# EAGLE board HedgeTrimmer_01 (EAGLE 9.4.2)
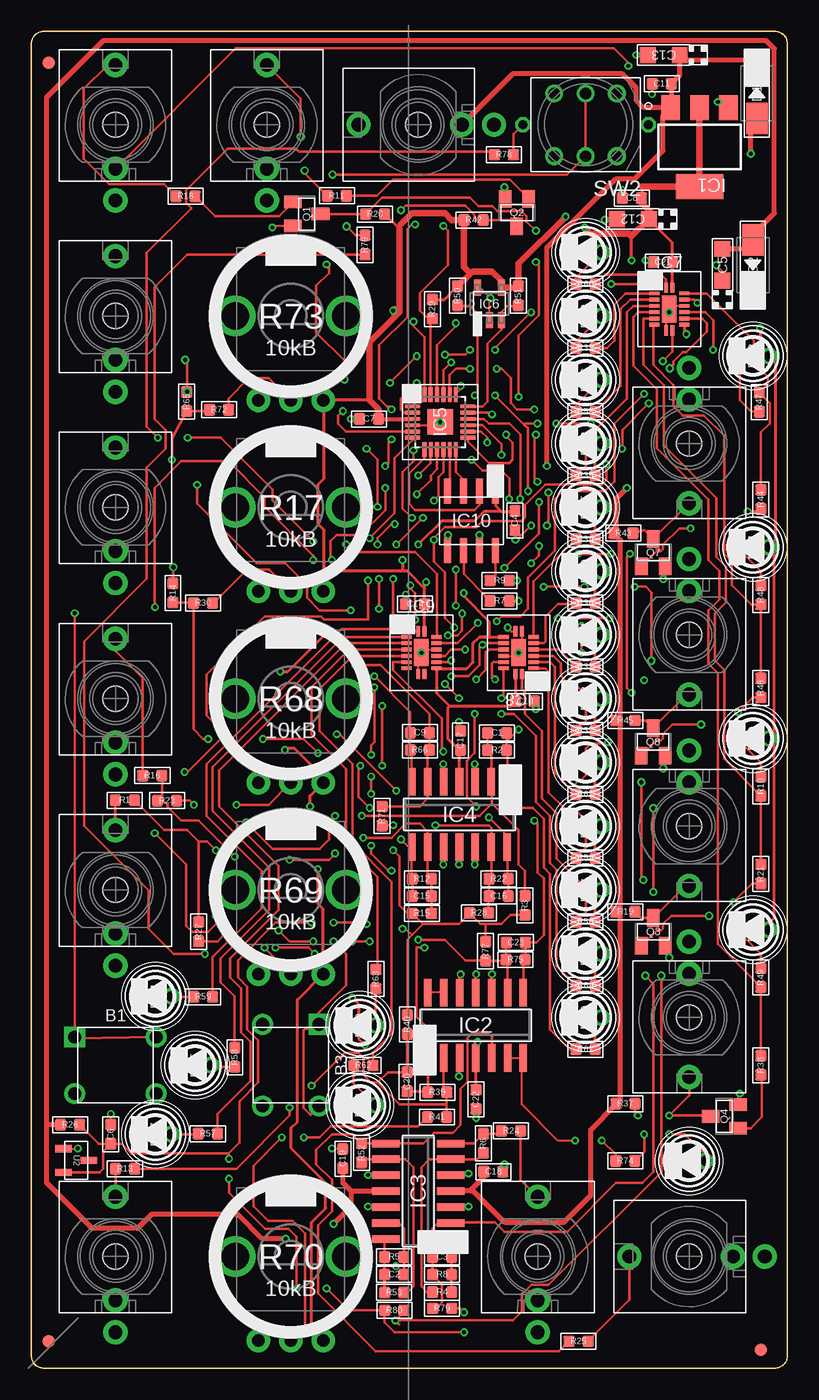
[diagram p6: board, top side]
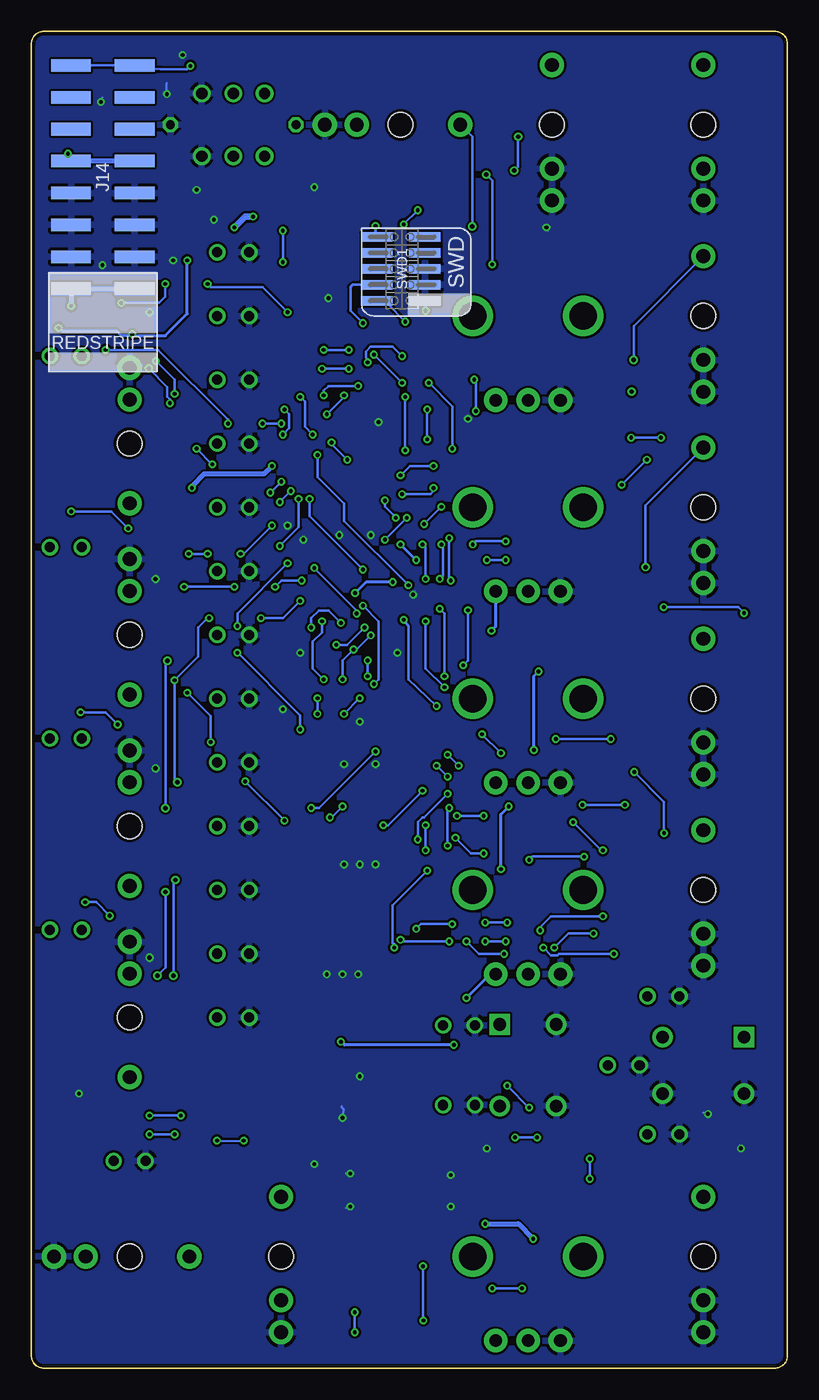
[diagram p7: board, bottom side, seen from below]

Size 60.25 x 106.5 mm. Coordinates in mm from the lower left corner, seen from the top.
Copper layers (1*16): Top 0.035mm / dielectric 1.5mm / Bottom 0.035mm
Design rules "dirt_cheap_dirty_boards.v1 *": minimum track width 5mil, minimum drill 12mil, track to track 5mil, track to pad 5mil, pad to pad 5mil, via to via 5mil, smd to smd 0mil, copper to edge 10mil, drill to drill 10mil, minimum pad ring 10mil, minimum via ring 6mil, stop-mask expansion 2mil, vias tented up to drill 25mil, thermal gap 10mil
Net classes: 0 default: width 0.203 mm, clearance 0.178 mm; 1 heavypower: width 0.381 mm; 2 mediumpower: width 0.254 mm; 3 groundplane: width 0.178 mm, clearance 0.178 mm

## Footprints (pad centres in the part's own frame; a part is rotated, then mirrored left to right if it is on the bottom)
4P-6.0X6.0X5.0H = drill 1.016 pad 1.651 square: 1 -3.25,2.25 | drill 1.016 pad 1.651: 2 -3.25,-2.25; 3 3.25,-2.25; 4 3.25,2.25
C0603 = smd 0.889 x 0.889: 1 -0.762,0; 2 0.762,0
CASE-A_3216 = smd 1.27 x 1.27: + -1.27,0; - 1.27,0
DO-214AC = smd 2.5 x 1.7: 1 -2,0; 2 2,0
3MMLED = drill 0.8: + -1.27,0; - 1.27,0
FIDUCIAL_1MM = smd 1 x 1: 1 0,0
SOT223 = smd 1.5 x 2: 1 -2.3,-3.15; 2 0,-3.15; 3 2.3,-3.15 | smd 3.8 x 2: 4 0,3.15
SO14 = smd 0.6 x 2.2: 1 -3.81,-2.6; 2 -2.54,-2.6; 3 -1.27,-2.6; 4 0,-2.6; 5 1.27,-2.6; 6 2.54,-2.6; 7 3.81,-2.6; 8 3.81,2.6; 9 2.54,2.6; 10 1.27,2.6; 11 0,2.6; 12 -1.27,2.6; 13 -2.54,2.6; 14 -3.81,2.6
QFN50P400X400X100-25N = smd 1.2 x 0.3: 1 -2.2,1.245; 2 -2.2,0.762; 3 -2.2,0.254; 4 -2.2,-0.254; 5 -2.2,-0.762; 6 -2.2,-1.245; 13 2.2,-1.245; 14 2.2,-0.762; 15 2.2,-0.254; 16 2.2,0.254; 17 2.2,0.762; 18 2.2,1.245 | smd 0.3 x 1.2: 7 -1.245,-2.2; 8 -0.762,-2.2; 9 -0.254,-2.2; 10 0.254,-2.2; 11 0.762,-2.2; 12 1.245,-2.2; 19 1.245,2.2; 20 0.762,2.2; 21 0.254,2.2; 22 -0.254,2.2 | smd 0.305 x 1.2: 23 -0.762,2.2; 24 -1.245,2.2 | smd 2.032 x 2.032: 25 0,0
SOT95P290X145-5N = smd 1.27 x 0.559: 1 -1.295,0.94; 2 -1.295,0; 3 -1.295,-0.94; 4 1.295,-0.94; 5 1.295,0.94
QFN50P250X350X100-17N = smd 0.305 x 0.813: 1 -0.254,1.702; 8 -0.254,-1.702; 9 0.254,-1.702; 16 0.254,1.702 | smd 0.813 x 0.305: 2 -1.194,1.245; 3 -1.194,0.762; 4 -1.194,0.254; 5 -1.194,-0.254; 6 -1.194,-0.762; 7 -1.194,-1.245; 10 1.194,-1.245; 11 1.194,-0.762; 12 1.194,-0.254; 13 1.194,0.254; 14 1.194,0.762; 15 1.194,1.245 | smd 1.143 x 2.159: 17 0,0
SOIC8-N_MC = smd 1.981 x 0.559: 1 -2.362,1.905; 2 -2.362,0.635; 3 -2.362,-0.635; 4 -2.362,-1.905; 5 2.362,-1.905; 6 2.362,-0.635; 7 2.362,0.635; 8 2.362,1.905
WQP_PJ_301M8 = drill 1.1 pad 1.93: P1 0,-6.032; P2 0,-3.493; P3 0,4.763 | hole 2: 0,0
2X08_SMT_HEADER = smd 1 x 3.17: 1 -8.89,-2.54; 2 -8.89,2.54; 3 -6.35,-2.54; 4 -6.35,2.54; 5 -3.81,-2.54; 6 -3.81,2.54; 7 -1.27,-2.54; 8 -1.27,2.54; 9 1.27,-2.54; 10 1.27,2.54; 11 3.81,-2.54; 12 3.81,2.54; 13 6.35,-2.54; 14 6.35,2.54; 15 8.89,-2.54; 16 8.89,2.54
SOT23-BEC = smd 1 x 1.4: B -0.95,-1.1; C 0,1.1; E 0.95,-1.1
R0603 = smd 0.889 x 0.889: 1 -0.762,0; 2 0.762,0
OG-POTS_ALPS_POT_VERTICAL = drill 1 pad 1.88: P$1 -2.58,-6.7; P$2 0,-6.7; P$3 2.58,-6.7 | drill 2.2 pad 3.175: P$4 4.4,0; P$5 -4.4,0
LP4OA1PBCT = drill 0.7 octagon: L1 5,0; L2 -5,0 | drill 0.9: P1 2.5,2.5; P2 0,2.5; P3 -2.5,2.5; P4 2.5,-2.5; P5 0,-2.5; P6 -2.5,-2.5
M50-3600542 = smd 0.75 x 2.5: 1 -2.54,-1.81; 2 -2.54,2; 3 -1.27,-1.81; 4 -1.27,2; 5 0,-1.81; 6 0,2; 7 1.27,-1.81; 8 1.27,2; 9 2.54,-1.81; 10 2.54,2
SOT95P237X112-3N = smd 1.321 x 0.559: 1 -1.016,0.94; 2 -1.016,-0.94; 3 1.016,0

## Placement (x,y rotation side)
B1  BUTTON-4P-3110040P1  [4P-6.0X6.0X5.0H]  6.7,24.13 0 top
B3  BUTTON-4P-3110040P1  [4P-6.0X6.0X5.0H]  20.67,24.13 270 top
C1  3.3nF  [C0603]  37.11,50.6 0 top
C2  3.3nF  [C0603]  28.91,7.46 180 top
C3  3.3nF  [C0603]  32.73,8.86 0 top
C4  100nF  [C0603]  38.54,67.53 90 top
C5  10uF  [CASE-A_3216]  55.07,87.9 90 top
C6  100nF  [C0603]  6.33,18.64 270 top
C7  100nF  [C0603]  26.9,75.62 0 top
C8  100nF  [C0603]  47.85,93.22 0 top
C9  3.3nF  [C0603]  30.95,50.62 180 top
C10  100nF  [C0603]  39.33,53.12 180 top
C11  100nF  [C0603]  50.24,102.32 0 top
C12  10uF  [CASE-A_3216]  47.93,91.55 180 top
C13  10uF  [CASE-A_3216]  50.39,104.62 180 top
C14  100nF  [C0603]  30.58,60.88 0 top
C15  3.3nF  [C0603]  31.11,37.6 180 top
C16  3.3nF  [C0603]  37.24,37.6 0 top
C17  100nF  [C0603]  34.2,50 90 top
C18  100nF  [C0603]  36.82,15.65 180 top
C19  100nF  [C0603]  24.82,16.69 270 top
C20  3.3nF  [C0603]  29.94,22.82 270 top
C21  100nF  [C0603]  50.33,88.12 0 top
C22  100nF  [C0603]  35.43,21.41 270 top
C23  3.3nF  [C0603]  38.61,33.9 0 top
D1  MRA4004T3G  [DO-214AC]  57.82,101.58 90 top
D2  MRA4004T3G  [DO-214AC]  57.5,87.88 270 top
D3  yellow  [3MMLED]  44.16,88.9 180 top
D4  yellow  [3MMLED]  44.16,48.26 180 top
D5  yellow  [3MMLED]  52.42,16.51 180 top
D24  yellow  [3MMLED]  9.88,29.62 180 top
D25  yellow  [3MMLED]  13.05,24.13 180 top
D26  yellow  [3MMLED]  44.16,38.1 180 top
D27  yellow  [3MMLED]  9.88,18.63 180 top
D28  yellow  [3MMLED]  26.17,20.95 180 top
D29  yellow  [3MMLED]  44.16,27.94 180 top
D30  yellow  [3MMLED]  26.17,27.3 180 top
D31  yellow  [3MMLED]  44.16,33.02 180 top
D32  yellow  [3MMLED]  44.16,83.82 180 top
D33  yellow  [3MMLED]  44.16,53.34 180 top
D34  yellow  [3MMLED]  44.16,58.42 180 top
D35  yellow  [3MMLED]  44.16,68.58 180 top
D36  yellow  [3MMLED]  44.16,78.74 180 top
D37  yellow  [3MMLED]  44.16,43.18 180 top
D38  yellow  [3MMLED]  44.16,73.66 180 top
D39  yellow  [3MMLED]  44.16,63.5 180 top
D40  yellow  [3MMLED]  57.5,50.16 180 top
D41  yellow  [3MMLED]  57.5,34.92 180 top
D43  yellow  [3MMLED]  57.5,80.64 180 top
D44  yellow  [3MMLED]  57.5,65.41 180 top
FID1  FIDUCIAL  [FIDUCIAL_1MM]  1.4,104.01 180 top
FID2  FIDUCIAL  [FIDUCIAL_1MM]  58.11,1.46 0 top
FID3  FIDUCIAL  [FIDUCIAL_1MM]  1.38,2.13 0 top
IC1  LD1117AS33TR  [SOT223]  53.25,97.28 180 top
IC2  MCP6004  [SO14]  35.4,27.32 0 top
IC3  TL074D  [SO14]  30.83,14.1 90 top
IC4  MCP6004  [SO14]  34.11,44.1 180 top
IC5  MKL02Z32VFK4  [QFN50P400X400X100-25N]  32.58,75.38 0 top
IC6  24LC16T-I/OT  [SOT95P290X145-5N]  36.5,84.8 90 top
IC7  74HC595BQ  [QFN50P250X350X100-17N]  50.83,84.38 0 top
IC8  74HC595BQ  [QFN50P250X350X100-17N]  38.83,57 180 top
IC9  74HC595BQ  [QFN50P250X350X100-17N]  31.08,57 0 top
IC10  MCP4822-E/SN  [SOIC8-N_MC]  35.08,67.5 270 top
J1  PJ301_THONKICONN8  [WQP_PJ_301M8]  6.7,68.58 0 top
J2  PJ301_THONKICONN8  [WQP_PJ_301M8]  6.7,53.34 0 top
J3  PJ301_THONKICONN8  [WQP_PJ_301M8]  6.7,38.1 0 top
J4  PJ301_THONKICONN8  [WQP_PJ_301M8]  6.7,8.89 0 top
J5  PJ301_THONKICONN8  [WQP_PJ_301M8]  6.7,99.06 0 top
J6  PJ301_THONKICONN8  [WQP_PJ_301M8]  18.76,99.06 0 top
J7  PJ301_THONKICONN8  [WQP_PJ_301M8]  52.42,43.18 180 top
J8  PJ301_THONKICONN8  [WQP_PJ_301M8]  52.42,27.94 180 top
J9  PJ301_THONKICONN8  [WQP_PJ_301M8]  30.83,99.06 90 top
J10  PJ301_THONKICONN8  [WQP_PJ_301M8]  52.42,73.66 180 top
J11  PJ301_THONKICONN8  [WQP_PJ_301M8]  52.42,58.42 180 top
J12  PJ301_THONKICONN8  [WQP_PJ_301M8]  40.35,8.89 0 top
J13  PJ301_THONKICONN8  [WQP_PJ_301M8]  52.42,8.89 90 top
J14  POWERSMT  [2X08_SMT_HEADER]  54.55,94.89 90 bottom
J15  PJ301_THONKICONN8  [WQP_PJ_301M8]  6.7,83.82 0 top
OUTLINE  EURORACK_PCB12HP  [EURORACK12HPPCB]  -0.25,0 0 top
Q1  MMBT3904  [SOT23-BEC]  21.94,91.95 270 top
Q2  MMBT3904  [SOT23-BEC]  38.69,92.06 180 top
Q3  MMBT3904  [SOT23-BEC]  49.56,34.77 0 top
Q4  MMBT3904  [SOT23-BEC]  55.22,20.06 90 top
Q7  MMBT3904  [SOT23-BEC]  49.56,64.98 0 top
Q8  MMBT3904  [SOT23-BEC]  49.55,49.89 0 top
R1  100k  [R0603]  7.45,45.24 180 top
R2  33k  [R0603]  37.11,49.23 180 top
R3  51k  [R0603]  39.34,36.87 270 top
R4  100k  [R0603]  32.73,6.05 180 top
R5  30k  [R0603]  28.91,8.86 0 top
R6  100k  [R0603]  36.03,17.91 90 top
R7  12k  [R0603]  37.32,61.12 180 top
R8  30k  [R0603]  32.73,7.46 180 top
R9  12k  [R0603]  37.32,62.75 180 top
R10  56  [R0603]  58.13,46.35 270 top
R11  100k  [R0603]  24.34,93.4 0 top
R12  33k  [R0603]  31.11,38.98 0 top
R13  100k  [R0603]  7.46,15.88 180 top
R14  100k  [R0603]  11.28,61.76 90 top
R15  51k  [R0603]  31.11,36.23 180 top
R16  100k  [R0603]  9.64,47.21 180 top
R17  10kB  [OG-POTS_ALPS_POT_VERTICAL]  20.67,68.58 0 top
R18  100k  [R0603]  12.29,93.36 0 top
R19  10k  [R0603]  47.34,36.35 180 top
R20  10k  [R0603]  27.39,91.94 0 top
R21  100k  [R0603]  58.13,39.37 270 top
R22  33k  [R0603]  37.24,38.98 180 top
R23  33k  [R0603]  10.81,45.21 0 top
R24  100  [R0603]  38.23,18.9 180 top
R25  100  [R0603]  43.6,2.13 180 top
R26  10k  [R0603]  3.08,19.39 0 top
R27  33k  [R0603]  13.34,34.77 270 top
R28  51k  [R0603]  35.67,36.27 180 top
R29  10k  [R0603]  31.95,84.38 270 top
R30  33k  [R0603]  13.69,60.96 0 top
R31  56  [R0603]  44.16,55.88 180 top
R32  56  [R0603]  44.16,50.8 180 top
R33  56  [R0603]  44.16,81.28 0 top
R34  56  [R0603]  44.16,66.04 180 top
R35  56  [R0603]  44.16,71.12 180 top
R36  56  [R0603]  44.16,60.96 180 top
R37  10k  [R0603]  47.34,21.07 180 top
R38  100k  [R0603]  58.13,24.13 270 top
R39  33k  [R0603]  32.35,21.98 0 top
R40  51k  [R0603]  29.95,27.38 90 top
R41  33k  [R0603]  32.33,20 180 top
R42  10k  [R0603]  35.25,91.47 180 top
R43  10k  [R0603]  47.18,66.52 180 top
R44  100k  [R0603]  58.13,69.22 270 top
R45  10k  [R0603]  47.34,51.59 180 top
R46  100k  [R0603]  58.13,54.19 270 top
R47  56  [R0603]  58.01,76.96 90 top
R48  56  [R0603]  58.13,61.59 270 top
R49  56  [R0603]  58.13,31.11 270 top
R50  2k  [R0603]  33.96,85.43 270 top
R51  2k  [R0603]  38.8,85.43 270 top
R52  100k  [R0603]  26.32,17.14 90 top
R53  100k  [R0603]  28.91,6.03 0 top
R54  56  [R0603]  44.16,40.64 180 top
R55  56  [R0603]  44.16,76.2 0 top
R56  56  [R0603]  44.16,35.56 180 top
R57  56  [R0603]  14.07,18.68 0 top
R58  56  [R0603]  16.21,24.77 90 top
R59  56  [R0603]  13.69,29.59 0 top
R60  56  [R0603]  44.16,86.36 0 top
R61  56  [R0603]  44.16,25.4 180 top
R62  56  [R0603]  26.45,24.12 0 top
R63  56  [R0603]  27.45,31 90 top
R64  56  [R0603]  44.16,30.48 180 top
R65  100k  [R0603]  12.38,77 90 top
R66  33k  [R0603]  30.95,49.25 0 top
R67  56  [R0603]  44.16,45.72 180 top
R68  10kB  [OG-POTS_ALPS_POT_VERTICAL]  20.67,53.34 0 top
R69  10kB  [OG-POTS_ALPS_POT_VERTICAL]  20.67,38.1 0 top
R70  10kB  [OG-POTS_ALPS_POT_VERTICAL]  20.67,8.89 0 top
R71  51k  [R0603]  27.95,43.99 270 top
R72  33k  [R0603]  14.96,76.36 0 top
R73  10kB  [OG-POTS_ALPS_POT_VERTICAL]  20.67,83.82 0 top
R74  56  [R0603]  47.33,16.51 180 top
R75  33k  [R0603]  38.59,32.55 180 top
R76  100k  [R0603]  26.59,89.48 90 top
R77  51k  [R0603]  36.2,33.22 90 top
R78  56  [R0603]  37.66,96.68 0 top
R79  1M  [R0603]  32.73,4.76 0 top
R80  1M  [R0603]  28.92,4.6 180 top
SW2  LP4OA1PBCT  [LP4OA1PBCT]  44.16,99.06 180 top
SWD1  CORTEX_SWD  [M50-3600542]  30.7,87.58 90 bottom
U2  LM4040DIM3-5.0  [SOT95P237X112-3N]  3.58,16.55 0 top

## Tracks (layer width: path | path; a pad name or v marks a point on that pad's centre or on a via)
3.3V  (via drill 0.3)
  Top 0.254: IC10.1 36.98,68.72 37.45,68.25 | 37.45,68.25 38.5,68.25 C4.2 | 48.65,93.18 C8.2 | 48.65,94.13 48.65,93.18 | 48.65,93.18 48.65,92.81 | D41.+ 58.77,35.44 59.2,35.88 59.2,49.73 D40.+ 58.77,50.19 59.2,50.62 59.2,64.97 D44.+ 58.77,65.44 59.33,66 59.33,80.08 D43.+ | 38.83,86.09 R51.1 | IC6.4 37.45,86.64 | 35.15,87.38 34.99,87.22 | 33.91,86.25 R50.1 32.91,85.14 R29.1 | R70.P$3 23.25,2.46 22.33,3.38 22.33,11.62 23.45,12.75 23.45,14.75 20.7,17.5 20.7,19.12 21.2,19.62 21.2,29.36 R69.P$3 23.25,36.58 22.83,37 v22.83,39.75 | R20.2 29.33,90.76 29.45,91.12 | IC5.3 | C22.1 35.43,24.68 IC2.4 | 36.21,58.24 35.7,58.24 35.2,57.75 35.2,56.25 34.7,55.75 IC9.10 32.27,53.81 33.33,52.75 | 36.21,58.24 36.45,58.24 | 36.45,58.24 IC8.10 | IC9.16 31.33,60.3 C14.2 31.34,62.11 | IC8.16 38.58,53.13 C10.2 38.19,52.75 33.33,52.75 | IC7.16 C21.2 arc-90 C21.2 51.09,89.65 C12.+ | R17.P$3 23.33,61.8 23.33,63.5 | 26.95,77.12 R73.P$3 23.33,77.04 23.33,70.88 22.83,70.38 22.83,67.25 23.33,66.75 23.33,63.5 | v28.83,84.25 28.95,84.38 | D43.+ 58.77,80.69 | IC7.10 52.02,82.56 v52.2,82.38 | v47.83,88.25 47.83,90.18 | v58.08,82.88 58.08,81.33 D43.+ | 29.45,63.5 29.95,63.5 31.34,62.11 | 29.45,63.5 23.33,63.5 | 37.45,68.25 36.08,68.25 35.33,67.5 32.7,67.5 v30.83,65.62 | v29.58,64.38 29.58,63.62 29.45,63.5 | IC4.4 34.11,49.15 C17.1 34.09,49.24 33.2,50.12 33.2,52.62 33.33,52.75 | IC2.4 35.4,25.82 v35.58,26 35.58,24.9 IC2.4 | v25.58,29.5 26.08,29 26.08,26.25 v26.58,25.75 | v22.2,44.75 22.2,45.59 R68.P$3 23.25,47.08 20.95,49.38 20.33,49.38 v20.2,49.25 | v19.83,55.5 20.45,55.5 23.58,58.62 v23.58,58.75 | 36.21,58.24 35.71,58.24 | 31.34,62.11 31.34,62.51 v31.45,62.62
  Top 0.254: v34.45,61.75 34.45,61.5 36.45,59.5 36.45,58.24
  Top 0.305: C7.2 IC5.3
  Top 0.508: IC1.2 IC1.4 48.65,94.13 | 48.65,92.81 49.33,92.12 49.33,91.68 C12.+ 47.83,90.18 47.64,90.38 44.58,90.38 v44.08,90.88 | IC6.4 38.83,86.09 | 37.45,86.64 36.7,87.38 35.15,87.38 | R50.1 34.99,87.22 34.49,87.72 R42.2 33.49,91.47 32.95,92 30.33,92 29.45,91.12 | 29.33,90.76 29.33,84.12 28.95,83.75 | C7.2 27.67,76.41 26.95,77.12 26.95,81.75 28.95,83.75 | 28.95,84.38 28.95,83.75 | R51.1 38.8,87.97 v42.58,91.75
  Bottom 0.254: SWD1.1 28.89,84.44 v28.83,84.25 | v47.83,88.25 47.83,84 49.58,82.25 52.08,82.25 v52.2,82.38 52.2,82.25 53.08,82.25 53.45,82.62 57.83,82.62 v58.08,82.88 | v30.83,65.62 v29.58,64.38 | R69.P$3 23.68,31.4 v25.58,29.5 | v26.58,25.75 35.33,25.75 v35.58,26 | v22.83,39.75 22.83,44.12 v22.2,44.75 | v20.2,49.25 20.2,55.12 v19.83,55.5 | R17.P$3 23.25,59.08 v23.58,58.75 | v31.45,62.62 33.58,62.62 v34.45,61.75
  Bottom 0.508: v42.58,91.75 43.2,91.75 v44.08,90.88
12V  (via drill 0.3)
  Top 0.381: C18.2 36.06,15.23 35.08,14.25 | 35.08,14.25 34.95,14.12 33.46,14.12 IC3.4 | IC1.3 51,100.49 C11.2 51.66,102.98 C13.+ 52.04,104.23 57.16,104.23 D1.2 | IC1.3 48.77,100.43 48.2,101 48.2,102 47.08,103.12 38.39,103.12 J9.P2 | 35.08,14.25 37.7,11.62 42.45,11.62 44.58,13.75 44.58,19 46.58,21 R37.2 46.95,21.45 46.95,35.98 R19.2 46.95,36.35 46.95,51.22 R45.2 46.95,51.59 46.95,65.98 R43.2 46.58,66.67 46.58,69.25 v47.45,70.12 | v41.08,71.88 41.08,89.25 46.58,94.75 48.08,94.75 50.33,97 50.33,99.82 IC1.3
  Bottom 0.381: v47.45,70.12 47.45,70.25 46.45,71.25 41.7,71.25 v41.08,71.88
-12V  (via drill 0.3)
  Top 0.381: IC3.11 25.48,14.1 25.45,14.12 | 25.45,14.12 24.83,14.75 24.83,15.92 C19.2 | C5.- 56.79,89.17 D2.1 57.5,90.3 59.2,92 59.2,105.12 58.58,105.75 5.71,105.75 1.21,101.25 1.21,19.38 | 25.45,14.12 25.45,12.88 v24.08,11.5 | v20.26,10.31 18.4,10.31 16.45,12.25 9.58,12.25 8.46,11.12 4.83,11.12 1.21,14.75 1.21,19.38 | R26.1 1.22,19.39 1.21,19.38
  Bottom 0.381: v24.08,11.5 21.45,11.5 v20.26,10.31
ADC_ATTACK  (via drill 0.3)
  Top 0.203: IC4.7 30.3,49.14 R66.1 C9.2 30.19,52.26 v27.33,55.12 | v27.7,60.5 v27.7,62.88 | v27.58,68.62 27.58,72.38 v26.7,73.25 | v28.95,67.25 28.7,67.25 27.58,66.12 v27.58,65.62 | v33.45,80.12 32.83,79.5 32.83,77.62 IC5.21 | v28.58,78.5 v30.7,80.62
  Bottom 0.203: v27.33,55.12 27.33,60.12 v27.7,60.5 | v28.58,78.5 26.7,76.62 v26.7,73.25 | v28.95,67.25 v27.58,68.62 | v27.58,65.62 27.45,65.5 27.45,63.12 v27.7,62.88 | v33.45,80.12 33.45,80.38 33.58,80.5 33.58,81 33.2,81.38 31.45,81.38 v30.7,80.62
ADC_CURVE  (via drill 0.3)
  Top 0.203: C20.2 31.51,22.06 R39.1 IC2.1 31.59,27.11 30.7,28 30.7,33.5 v31.33,33.5 | IC5.10 32.83,71.38 32.45,71 32.45,69.5 v32.08,69.12 | v27.33,54.25 27.33,49.88 27.08,49.62 v27.08,48.88 | v28.83,62.88 v28.83,59.5 | v31.2,67.75 v29.08,65.62 | v28.7,39.62 28.45,39.62 27.08,41 v27.08,41.62 | v26.95,44.62 26.08,45.5 26.08,47.88 v26.2,48
  Bottom 0.203: v32.08,69.12 32.08,68.62 v31.2,67.75 | v27.33,54.25 28.83,55.75 v28.83,59.5 | v28.83,62.88 28.83,65.38 v29.08,65.62 | v31.33,33.5 31.33,33.75 31.45,33.88 31.45,36.88 v28.7,39.62 | v27.08,41.62 27.08,44.5 v26.95,44.62 | v27.08,48.88 v26.2,48
ADC_DECAY  (via drill 0.3)
  Top 0.203: C16.2 R22.1 37.92,39.06 IC4.14 37.83,41.62 37.83,42.5 v36.45,43.88 | IC5.14 35.84,74.61 36.33,74.12 v36.33,73.75 | v38.08,69.25 38.08,70.88 37.45,71.5 35.95,71.5 v35.08,72.38 | v33.83,60.75 v33.83,63.62 | v34.08,53.38 v32.95,54.5 | v35.33,52.12 35.33,49 34.7,48.38 34.7,45.5 v35.45,44.75
  Bottom 0.203: v38.08,69.25 38.08,67.88 v33.83,63.62 | v33.83,60.75 32.58,59.5 32.58,54.88 v32.95,54.5 | v35.33,52.12 v34.08,53.38 | v35.45,44.75 36.33,43.88 v36.45,43.88 | v35.08,72.38 36.33,73.62 v36.33,73.75
ADC_RELEASE  (via drill 0.3)
  Top 0.203: IC4.1 37.92,49.18 R2.1 37.88,50 | 37.88,50 C1.2 | IC5.16 36.08,75.63 36.45,75.25 38.08,75.25 38.95,74.38 v38.95,69.25 | v40.45,65.5 40.45,64.75 v39.83,64.12 | v43.83,57 v43.83,59.12 | v38.83,50.88 37.95,50 37.88,50
  Bottom 0.203: v38.95,69.25 38.95,67 v40.45,65.5 | v39.83,64.12 43.83,60.12 v43.83,59.12 | v43.83,57 38.83,52 v38.83,50.88
ADC_SUSTAIN  (via drill 0.3)
  Top 0.203: C15.2 R12.1 30.3,39.03 IC4.8 30.2,41.38 v29.45,42.12 | IC5.15 35.96,75.12 37.45,73.62 v37.45,72.75 | v30.2,62.38 30.2,62.12 30.58,61.75 v30.58,59.62 | v27.95,48 v27.95,52.75 | v27.08,45.75 v27.08,47.12
  Bottom 0.203: v37.45,72.75 37.45,71 35.33,68.88 35.33,67.5 v30.2,62.38 | v30.58,59.62 30.2,59.12 30.2,54.88 v27.95,52.75 | v27.08,47.12 v27.95,48 | v27.08,45.75 28.95,43.88 29.08,43.88 29.45,43.5 v29.45,42.12
ADC_VELOCITY  (via drill 0.3)
  Top 0.203: IC2.8 39.21,32.4 R75.1 39.37,32.57 C23.2 40.23,33.9 40.83,34.5 40.83,39 40.33,39.5 40.33,43.38 v40.08,43.62 | v43.2,46.75 43.7,46.75 44.2,47.25 44.2,49.38 44.58,49.75 45.83,49.75 v45.95,49.88 | v47.83,53.81 47.45,54.19 47.45,64.62 v47.7,64.88 | v43.58,64.88 v46.2,64.88 | v41.2,69.75 41.2,67.25 v41.08,67.12 | v40.33,70.62 40.08,70.88 40.08,74.25 v40.2,74.38 | v40.08,76.38 38.7,76.38 38.2,76.88 38.2,78.88 37.45,79.62 v37.08,79.62 | v34.95,79.62 33.83,79.62 33.33,79.12 33.33,77.62 IC5.20
  Bottom 0.203: v43.2,46.75 v40.08,43.62 | v47.83,53.81 45.95,51.94 v45.95,49.88 | v46.2,64.88 v47.7,64.88 | v40.33,70.62 v41.2,69.75 | v40.2,74.38 39.7,74.88 39.7,76 v40.08,76.38 | v34.95,79.62 v37.08,79.62 | v41.08,67.12 43.33,64.88 v43.58,64.88
BUTTON_LOOP  (via drill 0.3)
  Top 0.203: B3.4 22.26,20.19 21.7,20.75 21.7,26.94 B3.1 22.83,28.25 25.08,30.5 25.08,33 v24.08,34 | IC5.6 30.38,73.92 28.95,72.5 28.95,68.12 v26.95,66.12 | v26.83,62.75 26.83,59.62 23.33,59.62 23.08,59.88 18.58,59.88 13.96,55.25 13.96,52 15.08,50.88 15.08,50.12 12.46,47.5 v12.21,47.5 | v22.45,34 20.58,34 v19.7,34.88 | v14.71,36 14.71,35.38 14.08,34.75 12.83,34.75 12.33,35.25 12.33,40.12 v9.83,42.62
  Bottom 0.203: v26.95,66.12 26.95,62.88 v26.83,62.75 | v24.08,34 v22.45,34 | v19.7,34.88 19.7,35.12 18.83,36 v14.71,36 | v9.83,42.62 9.83,45.12 v12.21,47.5
BUTTON_TIMERANGE  (via drill 0.3)
  Top 0.203: B1.1 3.46,26.37 3.46,26.29 | 3.46,26.29 9.93,26.4 B1.4 | IC5.9 32.33,71.62 31.83,71.12 31.83,70.75 v30.7,69.62 | 3.46,26.29 v3.46,60.15 v3.45,60.15 | v9.85,60.63 9.83,60.63 9.83,70.12 11.96,72.25 15.71,72.25 18.58,69.38 18.58,68.62 22.45,64.75 v22.45,64.38 | v23.95,64.38 23.83,64.5 23.83,65.88 24.33,66.38 26.2,66.38 28.2,68.38 v28.2,70.12
  Bottom 0.203: v3.45,60.15 3.93,60.62 6.83,60.62 6.84,60.63 v9.85,60.63 | v23.95,64.38 v22.45,64.38 | v30.7,69.62 28.45,69.62 28.2,69.88 v28.2,70.12
BUTTON_TRIGGER  (via drill 0.3, 0.35)
  Top 0.203: IC5.5 25.09,74.61 24.45,75.25 24.45,75.88 v24.83,76.25 | v24.95,78.75 24.95,80.25 22.7,82.5 22.7,86.25 23.7,87.25 23.7,87.75 v23.52,87.94 | SW2.P5 SW2.P2 42.7,95.09 v24,95.09
  Bottom 0.203: v24.83,76.25 24.83,78.62 v24.95,78.75 | v23.52,87.94 23.52,94.61 v24,95.09
CLOCK  (via drill 0.3, 0.35)
  Top 0.203: IC9.11 32.29,56.25 33.45,56.25 arc90 v33.45,56.38 | v33.45,55.12 34.83,55.12 35.7,56 35.7,57.5 35.89,57.69 | 35.89,57.69 35.97,57.76 IC8.11 | IC7.11 53.47,83.61 53.83,83.25 53.83,82.59 52.18,80.94 51.9,80.94 51.17,80.21 51.17,79.94 v50.88,79.64 | v30.45,77.38 30.45,76.62 IC5.1 | v30.45,73.12 30.45,72.25 29.58,71.38 29.58,68.5 v30.33,67.75 | v35.95,57.62 35.89,57.69 | v49.2,76.88 47.08,74.75 v47.08,73.25 | v45.83,72 45.83,70.75 45.45,70.38 40.95,70.38 39.33,68.75 39.33,67.75 39.08,67.5 35.95,67.5 35.45,67 32.95,67 32.08,66.12 v32.08,66 32.08,64.25 32.95,63.38 32.95,59.75 v33.7,59
  Bottom 0.203: v33.45,56.38 v33.45,55.12 | v30.45,73.12 v30.45,77.38 | v32.08,66 v30.33,67.75 | v45.83,72 v47.08,73.25 | v35.95,57.62 35.08,57.62 v33.7,59 | v49.2,76.88 49.2,77.17 49.41,77.38 49.41,78.17 v50.88,79.64
CPU_RESET  (via drill 0.3)
  Top 0.203: IC5.23 31.82,83.48 R29.2 31.59,83.61 30.95,84.25 30.95,85.62 33.2,87.88 33.2,90.62 v32.83,91
  Bottom 0.203: v32.83,91 32.83,90.25 SWD1.10
D21
  Top 0.203: R47.1 57.38,76.2 56.45,77.12 56.45,80.42 D43.-
DACA_INPUTSUMMER  (via drill 0.3, 0.35)
  Top 0.203: C2.1 29.68,8.19 | 29.68,8.19 R5.2 29.68,11.15 29.33,11.5 28.29,11.5 IC3.13 | 29.68,8.19 29.05,8.19 v29.05,8.12 | R9.1 v38.7,62.75 | v40.83,62.25 v44.08,62.25 | v48.08,62.25 48.95,62.25 49.45,61.75 49.4,61.7 v49.4,56.36 | R80.1 29.65,4.41 v29.01,3.8 | 29.31,3.5 v29.01,3.8 | v29.01,3.8 38.38,3.8 39.11,4.53 39.11,5.91 39.84,6.64 41.22,6.64 50.2,15.62 v50.2,31.27 | v49.56,37.94 v49.56,44.61
  Bottom 0.203: v29.05,8.12 29.05,3.83 v29.01,3.8 | v38.7,62.75 40.33,62.75 v40.83,62.25 | v44.08,62.25 v48.08,62.25 | v49.56,37.94 49.56,31.91 v50.2,31.27 | v49.56,44.61 49.56,56.2 v49.4,56.36
DACB_INPUTSUMMER  (via drill 0.3, 0.35)
  Top 0.203: 33.36,11.62 32.45,11.62 31.97,11.14 C3.1 R8.2 32.73,6.7 32.73,5.24 32.26,4.76 R79.1 | 33.36,11.62 IC3.2 | 33.36,11.62 36.95,11.62 37.7,10.88 42.7,10.88 46.58,14.75 48.7,14.75 49.58,15.62 49.58,30.62 v48.93,31.27 | R7.1 v38.83,61.12 | v41.95,59.75 v46.08,59.75 | v48.61,46.67 48.61,39.05 v48.77,38.89
  Bottom 0.203: v46.08,59.75 46.2,59.75 46.95,59 46.95,56.69 v48.84,54.81 48.84,46.9 v48.61,46.67 | v41.95,59.75 40.2,59.75 v38.83,61.12 | v48.93,31.27 48.93,38.73 v48.77,38.89
DACCS
  Top 0.203: IC10.2 35.71,68.76 35.33,68.38 30.58,68.38 30.08,68.88 30.08,71.25 31.33,72.5 IC5.7
DACSCK
  Top 0.203: IC5.12 33.82,71.38 34.45,70.75 34.45,69.87 IC10.3
DACSDI
  Top 0.203: IC5.11 33.34,70.03 IC10.4
EXTGATE  (via drill 0.3)
  Top 0.203: v47.58,103.75 47.58,104 46.42,105.16 16.29,105.16 J5.P2
  Bottom 0.203: J14.16 J14.15 50.99,103.53 49.95,103.5 47.83,103.5 v47.58,103.75
GND  (via drill 0.3, 0.35)
  Top 0.178: IC1.1 55.15,100.43 v54.7,100.88 | C5.+ 55.07,87.38 v54.58,87.88 | C13.- 48.21,104.62 v48.2,104.62 | C11.1 49.51,102.45 v49.45,101.5 | Q4.E 56.32,21.74 v56.45,21.88 | Q1.E 19.33,91 v19.2,90.88 | C19.1 24,17.45 v23.95,17.5 | IC3.10 26.84,15.37 v26.83,15.38 | IC3.5 34.7,15.37 v34.83,15.5 | IC3.12 26.88,12.83 v26.83,12.88 | IC3.3 34.78,12.83 v34.83,12.88 | C8.1 v47.09,93.87 v47.08,93.88 | C12.- 45.75,91.55 v45.7,91.5 | IC6.5 35.74,86.09 v36.58,85.25 36.5,85.17 IC6.2 | IC4.5 32.84,48.11 v32.83,48.12 | IC4.3 35.38,48.07 v35.33,48.12 | IC4.10 32.84,40.14 v32.83,40.12 | IC4.11 34.11,40.16 v34.08,40.12 | IC4.12 35.38,40.18 v35.33,40.12 | C17.2 34.2,51.38 v34.08,51.5 | IC5.4 32.33,75.12 IC5.25 | IC10.7 35.71,66.36 v35.7,66.38 | IC10.5 33.17,66.34 v33.2,66.38 | IC2.10 36.67,31.34 v36.7,31.38 | IC2.11 35.4,31.32 v35.45,31.38 | IC2.12 34.13,31.3 v34.2,31.38 | IC2.3 34.13,23.3 v34.08,23.25 | C22.2 35.48,20.27 v35.45,19.94 | IC9.13 31.33,57.25 IC9.17 30.83,56.75 IC9.8 | IC8.17 38.58,57.25 | IC8.13 38.58,56.75 arc90 IC8.17 | IC8.8 39.08,57.25 arc-90 IC8.17 | C14.1 29.82,61.61 v29.83,61.62 | C10.1 40.09,52.61 v40.2,52.5 | IC7.8 50.58,84.12 v50.83,84.12 arc-90 51.08,84.63 IC7.13 | C21.1 49.08,88.12 v48.95,88.25 | C7.1 v25.45,75.62 | U2.1 v3.7,17.49 v3.71,17.5 | C6.1 v6.33,20.25 | C18.1 37.79,15.46 37.83,15.5 37.7,15.62 v37.7,16.25 37.83,16.38 | v39.83,67.12 38.7,66 v38.58,66 38.54,66.04 C4.1
  Top 0.203: Q3.E 50.51,33.02 v50.83,32.7 | Q2.E 37.7,93.2 v37.7,94.08 | Q7.E 50.51,63.02 v50.36,62.87 | Q8.E 50.5,47.92 v50.36,47.78 | IC7.17 v50.83,84.12
  Bottom 0.178: v54.7,100.88 54.7,101.12 54.58,101.25 | v48.2,104.62 47.95,104.62 | v49.45,101.5 49.45,102.38 | v56.45,21.88 56.45,22 | v19.2,90.88 19.2,90.75 19.08,90.62 | v23.95,17.5 23.7,17.5 | v26.83,15.38 26.7,15.38 26.58,15.25 | v34.83,15.5 35.2,15.5 | v26.83,12.88 26.58,12.88 | v34.83,12.88 35.08,12.88 35.2,12.75 | v47.08,93.88 47.08,94 | v45.7,91.5 45.58,91.5 | v36.58,85.25 36.58,85 | v32.83,48.12 32.83,48.38 | v35.33,48.12 35.45,48.25 | v32.83,40.12 32.83,40 | v34.08,40.12 34.08,40 | v35.33,40.12 35.45,40 | v34.08,51.5 34.2,51.5 | v35.7,66.38 35.7,66.5 | v33.2,66.38 33.2,66.62 | 38.58,66.12 v38.58,66 | v36.7,31.38 36.83,31.38 | v35.45,31.38 35.7,31.38 | v34.2,31.38 34.33,31.38 | v34.08,23.25 34.08,23.12 | v35.45,19.94 35.33,20.56 35.52,20.88 | v29.83,61.62 29.83,61.75 29.7,61.88 | v40.2,52.5 40.2,52.25 | v48.95,88.25 48.7,88.25 | v25.45,75.62 25.2,75.62 | v3.71,17.5 3.71,17.62 3.83,17.75 | v6.33,20.25 6.58,20.25 6.71,20.38 | v37.7,16.25 37.95,16.25 | v39.83,67.12 40.08,67.25
  other vias: 31.08,57 38.83,57 32.58,75.38
  pour Bottom: -2.45,109.29 -2.45,-2.47 61.58,-2.54 61.58,109.22
KNOB_ATTACK
  Top 0.203: R73.P$2 18.91,78.88 17.33,78.88 15.72,77.26 R72.2
KNOB_CURVE  (via drill 0.3)
  Top 0.203: v19.95,18.38 17.7,16.12 17.7,12.91 18.86,11.75 20.83,11.75 21.83,10.75 21.83,3.35 R70.P$2 | v21.7,18.38 22.95,18.38 23.83,19.25 30.82,19.25 R41.2
  Bottom 0.203: v19.95,18.38 v21.7,18.38
KNOB_DECAY
  Top 0.203: R17.P$2 18.92,63.62 17.2,63.62 14.54,60.96 R30.2
KNOB_RELEASE  (via drill 0.3)
  Top 0.203: R27.2 14.84,34.01 v15.46,34.62 | v18.58,33.5 v18.58,33.49 R69.P$2
  Bottom 0.203: v15.46,34.62 17.45,34.62 v18.58,33.5
KNOB_SUSTAIN  (via drill 0.3)
  Top 0.203: 20.67,46.59 R68.P$2 18.9,44.88 v16.33,44.88 | R23.2 12.62,45.21 v12.96,44.88
  Bottom 0.203: v16.33,44.88 v12.96,44.88
LATCH  (via drill 0.3)
  Top 0.203: IC9.12 32.95,56.75 33.45,57.25 v34.58,57.25 | v35.45,54.88 36.2,55.62 36.2,57 36.46,57.25 IC8.12 | IC7.12 53.71,84.12 54.33,83.5 v54.33,81.12 | 39.27,75.19 v36.95,77.5 | 39.27,75.19 39.58,74.88 v39.58,69.88 | v40.45,69 40.45,66.5 v37.7,63.75 | IC5.19 33.83,77.62 34.2,78 v34.2,78.25 | v41.83,75.25 v44.58,75.25 | v40.33,75.25 39.33,75.25 39.27,75.19 | v33.2,58.38 33.95,58.38 34.33,58.75 v34.33,60.12
  Bottom 0.203: v35.45,54.88 35.45,56.38 v34.58,57.25 34.33,57.25 v33.2,58.38 | v40.45,69 v39.58,69.88 | v54.33,81.12 50.14,81.12 44.58,75.57 v44.58,75.25 | v40.33,75.25 v41.83,75.25 | v34.33,60.12 34.33,60.38 v37.7,63.75 | v36.95,77.5 36.95,77.88 36.58,78.25 v34.2,78.25
N$1  (via drill 0.35)
  Top 0.203: R65.2 v12.42,77.8 12.42,80.17 v12.26,80.33
  Bottom 0.203: J15.P3 12.26,83.03 v12.26,80.33
N$2
  Top 0.203: R6.1 35.52,16.64 IC3.6 33.42,16.62 31.7,16.62 31.08,16 31.08,6.5 31.53,6.05 R4.2
N$3
  Top 0.203: J2.P3 6.7,57.15 8.88,54.97 R16.2
N$4  (via drill 0.3)
  Top 0.203: R15.1 C15.1 R12.2 31.57,39.28 IC4.9 31.57,42.76 30.95,43.38 29.83,43.38 28.7,42.25 v26.45,42.25 | v16.2,40.75 13.33,43.62 11.94,43.62 10.85,44.72 10.85,44.86 10.49,45.21 R23.1 10.4,45.57 R16.1 | v20.58,40.5 23.7,40.5 v24.2,41
  Bottom 0.203: v24.2,41 25.2,41 v26.45,42.25 | v16.2,40.75 20.33,40.75 v20.58,40.5
N$5
  Top 0.203: IC10.8 36.98,63.18 R9.2
N$6
  Top 0.203: J3.P3 6.69,42.87 R1.2
N$7
  Top 0.203: R7.2 36.2,61.5 34.45,63.25 34.45,65.13 IC10.6
N$8  (via drill 0.3)
  Top 0.203: 36.7,45 36.7,46.66 IC4.2 36.66,48.93 R2.2 C1.1 | R1.1 10.58,42.88 12.41,42.88 13.34,41.95 | 13.34,41.95 R27.1 13.37,35.5 | R3.1 39.33,37.64 39.33,39.62 38.83,40.12 38.83,42.88 36.7,45 | 36.7,45 35.7,44 v26.33,44 | 13.34,41.95 14.01,41.95 v14.71,41.25 | v17.08,43.5 19.2,41.38 22.95,41.38 23.7,42.12 23.7,43.5 v24.2,44
  Bottom 0.203: v24.2,44 v26.33,44 | v14.71,41.25 14.83,41.25 v17.08,43.5
N$9  (via drill 0.35)
  Top 0.203: v11.3,63.82 11.3,62.54 R14.2
  Bottom 0.203: J1.P3 11.3,68.74 v11.3,63.82
N$10
  Top 0.203: R78.2 38.42,98.31 SW2.L1
N$11
  Top 0.203: J4.P3 R13.2
N$12
  Top 0.203: J12.P3 38.99,15.02 R24.1
N$13  (via drill 0.3)
  Top 0.381: v57.33,96.75 57.33,100.52 D1.1
  Bottom 0.381: J14.9 J14.10 57.09,96.52 v57.33,96.75
N$14
  Top 0.203: IC8.7 40.02,62.66 R34.2
N$15
  Top 0.203: 20.63,93.11 Q1.B 19.72,91.78 14.63,91.78 R18.2
N$16
  Top 0.203: R18.1 10.56,94.32 6.18,94.32 4.16,96.35 4.16,101.92 6.07,103.82 J5.P3
N$17
  Top 0.203: R53.2 29.98,6.03 30.45,6.5 30.45,16 29.83,16.62 28.24,16.62 IC3.9 26.57,16.64 R52.1
N$18
  Top 0.203: R4.1 R8.1 C3.2 33.5,10.22 IC3.1
N$19  (via drill 0.3)
  Top 0.178: IC2.6 IC2.7 39.08,24.59 39.08,21 41.95,18.12 v43.33,18.12 | R74.2 46.57,17.01 v45.45,18.12
  Bottom 0.178: v45.45,18.12 v43.33,18.12
N$20
  Top 0.203: R25.1 47.66,5.43 J13.P3
N$21  (via drill 0.35)
  Top 0.203: R11.1 21.78,95.2 v21.78,95.41 | v21.46,98.11 21.46,101.12 J6.P3
  Bottom 0.203: v21.78,95.41 21.46,95.73 v21.46,98.11
N$22  (via drill 0.3)
  Top 0.203: R72.1 14.08,76.24 R65.1 11.21,74.11 v11.21,72.38 | R71.1 28.7,44.75 30.95,44.75 31.57,45.37 IC4.6 31.57,49.11 R66.2 C9.1 31.72,52.11 27.83,56 v25.83,56 | v13.21,70.38 13.21,68.88 17.95,64.12 20.2,64.12 21.95,62.38 21.95,61.38 22.95,60.38 v25.45,60.38
  Bottom 0.203: v13.21,70.38 v11.21,72.38 | v25.45,60.38 25.45,56.38 v25.83,56
N$23
  Top 0.203: R10.1 58.13,48.26 D40.-
N$24
  Top 0.203: R53.1 C2.2 R5.1 28.15,10.21 IC3.14
N$25  (via drill 0.3, 0.35)
  Top 0.203: v55.95,37.12 57.44,38.61 R21.2 | v54.01,36.04 50.98,36.04 50.34,35.4 50.34,35.05 50.18,34.89 49.83,34.89 Q3.B
  Bottom 0.203: v54.01,36.04 55.1,37.12 v55.95,37.12
N$26
  Top 0.178: IC2.13 IC2.14
N$27  (via drill 0.3)
  Top 0.203: R64.2 41.83,32.05 41.83,39.75 41.33,40.25 41.33,44 40.2,45.12 40.2,50.38 38.45,52.12 v37.45,52.12 | v37.45,53.38 37.64,53.56 IC8.15
  Bottom 0.203: v37.45,52.12 v37.45,53.38
N$28
  Top 0.203: R62.1 25.69,22.7 D28.+
N$29
  Top 0.203: 48.08,36.33 R19.1 48.59,35.87 Q3.C 52.11,38.42 J7.P3
N$30
  Top 0.203: R67.1 44.93,47.75 D4.+
N$31
  Top 0.203: IC7.1 50.58,86.75 50.2,87.12 45.69,87.12 R60.2
N$32
  Top 0.203: R61.1 44.93,27.43 D29.+
N$33  (via drill 0.35)
  Top 0.203: R76.2 25.83,90.25 v25.11,90.96
  Bottom 0.203: v25.11,90.96 25.11,98.11 J9.P3
N$34  (via drill 0.3)
  Top 0.203: R28.1 36.43,37.56 C16.1 R22.2 36.66,39.16 IC4.13 36.66,43.05 36.45,43.25 v32.2,43.25 | R14.1 12.89,60.99 R30.1 12.92,50.91 13.71,50.12 v14.08,50.12 | v29.08,46 24.58,50.5 v24.33,50.5 | v18.45,50.12 21.7,50.12 v22.83,49
  Bottom 0.203: v32.2,43.25 31.83,43.25 v29.08,46 | v14.08,50.12 v18.45,50.12 | v22.83,49 v24.33,50.5
N$35
  Top 0.203: IC7.2 47.33,85.62 46.45,84.75 46.45,81.88 45.86,81.28 R33.2
N$36
  Top 0.203: IC7.3 47.72,85.14 46.95,84.38 46.95,78.23 R55.2
N$37
  Top 0.203: IC7.4 47.96,84.63 47.45,84.12 47.45,77.25 44.2,74 44.2,71.92 R35.2
N$38
  Top 0.203: IC8.1 39.08,54.12 39.33,53.88 39.33,52.12 40.7,50.75 40.7,45.38 41.83,44.25 41.83,40.62 44.2,38.25 44.2,36.36 R56.2
N$39
  Top 0.203: IC8.2 40.95,55.76 41.2,55.5 41.2,45.88 42.58,44.5 43.33,44.5 44.2,43.62 44.2,41.5 43.45,40.75 | 43.45,40.75 43.33,40.62 | 43.45,40.75 R54.2
N$40
  Top 0.203: IC8.3 41.34,56.24 41.7,55.88 41.7,47.42 R67.2
N$41
  Top 0.203: IC8.4 41.58,56.75 42.2,56.12 42.2,55.12 42.83,54.5 43.33,54.5 44.2,53.62 44.2,51.6 R32.2
N$42
  Top 0.203: IC8.5 42.03,57.25 R31.2
N$43
  Top 0.203: R11.2 27.55,93.4 28.81,94.67 38.14,94.67 Q2.B
N$44
  Top 0.203: R49.1 58.13,33.02 D41.-
N$45
  Top 0.203: R48.1 58.13,63.5 D44.-
N$46  (via drill 0.3)
  Top 0.203: 33.15,21.95 R39.2 | IC2.2 32.86,22.23 R39.2 | 29.94,26.62 R40.1 29.94,26.6 C20.1 28.41,23.58 27.58,22.75 | R13.1 16.34,15.88 20.58,20.12 v20.58,20.75 | 27.58,22.75 27.08,22.75 26.45,23.38 26.45,24.75 26.08,25.12 24.95,25.12 v22.33,22.5 | R41.1 33.09,21 | 33.09,21 33.09,21.96 R39.2 | 33.09,21 29.33,21 27.58,22.75
  Bottom 0.203: v20.58,20.75 v22.33,22.5
N$48
  Top 0.203: IC8.6 40.84,57.76 40.95,57.88 40.95,59.88 41.95,60.88 43.32,60.88 R36.2
N$49
  Top 0.203: IC9.1 30.63,58.7 30.45,58.88 24.7,58.88 13.96,48.12 13.96,44 18.33,39.62 18.33,36.62 14.45,32.74 R59.2
N$50
  Top 0.203: IC9.2 24.82,58.24 14.46,47.88 14.46,44.38 18.95,39.88 18.95,36.5 15.08,32.62 15.08,30.75 16.21,29.61 R58.2
N$51
  Top 0.203: R60.1 43.4,86.87 D3.+
N$52
  Top 0.203: IC9.3 25.09,57.76 14.96,47.62 14.96,44.75 19.7,40 19.7,36.5 15.83,32.62 15.83,31.12 16.7,30.25 16.7,26.75 17.45,26 17.45,22.88 14.83,20.25 R57.2
N$53
  Top 0.203: IC9.4 25.33,57.25 22.33,54.25 22.33,50.5 25.08,47.75 25.08,41.62 27.58,39.12 27.58,31.89 R63.2
N$54
  Top 0.203: IC9.5 25.58,56.75 22.95,54.12 22.95,50.75 25.58,48.12 25.58,41.88 28.7,38.75 28.7,26.62 27.22,25.14 R62.2
N$55  (via drill 0.3)
  Top 0.203: R61.2 42.93,25.4 41.33,27 41.33,39.38 40.83,39.88 40.83,43.75 39.95,44.62 v37.95,44.62 | v32.83,49.12 32.7,49.25 32.7,51.75 28.83,55.62 28.83,56.25 29.83,56.25 IC9.6
  Bottom 0.203: v37.95,44.62 37.33,44.62 v32.83,49.12
N$56  (via drill 0.3)
  Top 0.203: IC2.9 37.94,32.43 R75.2 | R75.2 37.83,33.88 C23.1 37.85,34.14 | R75.2 37.74,32.46 R77.1 36.08,32.5 34.58,32.5 32.95,34.12 v30.83,34.12 | R76.1 12.43,88.72 9.83,86.12 9.83,75.62 10.71,74.75 10.71,73.25 9.21,71.75 9.21,62.9 4.21,57.9 4.21,43.18 9.34,38.04 9.34,34.99 11.33,33 v13.83,33 | v19.45,33.5 22.08,33.5 v22.58,33 | v26.95,34 v25.58,34
  Bottom 0.203: v13.83,33 18.2,33 18.33,32.88 18.83,32.88 v19.45,33.5 | v22.58,33 24.58,33 v25.58,34 | v26.95,34 30.7,34 v30.83,34.12
N$57
  Top 0.203: Q4.B 57.31,19.11 58.2,20 58.2,23.3 R38.2
N$58  (via drill 0.3)
  Top 0.203: R37.1 48.1,20.35 v48.33,20.12 | Q4.C 54.05,20.12 v50.83,20.12 52.42,21.71 J8.P3
  Bottom 0.203: v48.33,20.12 v50.83,20.12
N$59  (via drill 0.3)
  Top 0.203: D5.+ 53.69,17.02 52.08,18.62 v50.83,18.62 | v48.83,18.62 48.83,17.25 R74.1
  Bottom 0.203: v50.83,18.62 v48.83,18.62
N$64  (via drill 0.3)
  Top 0.381: v57.08,84.62 57.08,85.21 D2.2
  Bottom 0.381: J14.1 J14.2 57.09,84.89 v57.08,84.62
N$68  (via drill 0.3)
  Top 0.203: v57.08,68.25 57.93,68.25 R44.2 | 48.92,63.88 Q7.B 49.83,65.1 50.18,65.1 50.34,65.26 50.34,65.61 51.63,66.89 v52.54,66.89
  Bottom 0.203: v52.54,66.89 53.89,68.25 v57.08,68.25
N$69
  Top 0.203: R43.1 48.85,66.79 Q7.C 52.38,68.9 J10.P3
N$71  (via drill 0.3, 0.35)
  Top 0.203: v56.33,52.25 57.51,53.43 R46.2 | v53.37,51.28 51.09,51.28 50.33,50.52 50.33,50.17 50.16,50.01 49.82,50.01 Q8.B
  Bottom 0.203: v53.37,51.28 54.35,52.25 v56.33,52.25
N$72
  Top 0.203: 48.2,51.49 R45.1 48.94,51.59 Q8.C 52.22,53.66 J11.P3
N$73
  Top 0.203: D27.+ 13.25,18.63 R57.1
N$74
  Top 0.203: R56.1 44.93,37.59 D26.+
N$75
  Top 0.203: R58.1 14.45,24 D25.+
N$76
  Top 0.203: R59.1 11.17,29.59 D24.+
N$77
  Top 0.203: D30.+ 27.44,30.23 R63.1
N$78
  Top 0.203: R64.1 44.93,32.51 D31.+
N$79
  Top 0.203: R33.1 43.4,81.79 D32.+
N$80
  Top 0.203: R32.1 44.93,52.83 D33.+
N$81
  Top 0.203: R31.1 44.93,57.91 D34.+
N$82
  Top 0.203: R34.1 44.93,68.07 D35.+
N$83
  Top 0.203: R55.1 43.4,76.71 D36.+
N$84
  Top 0.203: R54.1 44.93,42.67 D37.+
N$85
  Top 0.203: R35.1 44.93,73.15 D38.+
N$86
  Top 0.203: R36.1 44.93,62.99 D39.+
OUT_ATTACK
  Top 0.203: IC7.15 53.84,85.62 57.58,81.88 57.58,80.12 58.7,79 58.7,78.42 R47.2 58.83,76.9 58.83,75.25 58.13,74.56 R44.1
OUT_CUR_PRERES
  Top 0.203: R25.2 42.05,1.34 27.44,1.34 22.83,5.96 22.83,11.38 23.95,12.5 23.95,15 22.7,16.25 22.7,17.38 23.95,18.62 25.6,18.62 R52.2 IC3.8 31.24,17.91 32.08,18.75 33.58,18.75 34.2,19.38 34.2,22.25 34.77,22.81 34.77,26.31 35.2,26.75 36.33,26.75 36.7,26.38 36.7,24.68 | 36.7,24.12 36.7,24.68 | 36.7,24.68 IC2.5
OUT_DECAY
  Top 0.203: R46.1 R48.2 57.37,60.83 55.83,62.38 55.83,64.25 55.2,64.88 55.2,74.28 53.58,75.91 51.9,75.91 51.17,76.64 51.17,78.31 49.56,79.93 49.56,83.05 IC7.7
OUT_LIN_PRERES
  Top 0.203: IC3.7 35.26,17.91 R6.2 37.23,18.67 R24.2
OUT_RELEASEDONE
  Top 0.203: R38.1 R49.2 54.7,33.78 54.7,55.38 53.95,56.12 53.95,60.38 54.83,61.25 54.83,63.5 53.95,64.38 53.95,69.19 49.83,73.31 49.83,78 47.95,79.88 47.95,83.75 48.33,84.12 IC7.5
OUT_RELEASESTART
  Top 0.203: R21.1 R10.2 55.2,48.52 55.2,55.62 54.45,56.38 54.45,60.12 55.33,61 55.33,63.88 54.58,64.62 54.58,69.31 50.39,73.5 50.39,78.33 48.77,79.95 48.77,83.62 49.62,83.62 IC7.6
REF_-5V  (via drill 0.3)
  Top 0.203: R3.2 38.19,36.11 37.45,35.38 36.08,35.38 | 36.08,35.38 35.8,35.38 R28.2 34.91,36.2 34.08,35.38 31.21,35.38 | 31.21,35.38 R15.2 29.97,36.23 29.33,36.88 29.33,40.75 v28.83,41.25 | 30.33,34.5 29.95,34.12 R40.2 | 30.33,34.5 31.21,35.38 | R77.2 36.2,35.25 36.08,35.38 | v28.83,43.25 27.97,43.25 R71.2 | U2.2 5.44,15.61 5.71,15.88 5.71,17.25 C6.2 | C6.2 5.36,17.88 R26.2 | C6.2 7.2,17.88 7.96,17.12 15.71,17.12 | 15.71,17.12 16.58,18 16.58,21.25 18.08,22.75 18.08,26.12 17.2,27 17.2,30.38 16.45,31.12 16.45,32.5 19.45,35.5 v22.33,35.5 | v24.08,35.5 26.58,35.5 v26.7,35.38 | v29.58,35 29.83,35 30.33,34.5 | R79.2 34.16,4.76 v34.48,4.45 | v23.53,6.35 25.27,4.6 R80.2 28.13,4.57 28.13,3.65 28.92,2.86 v34.48,2.86 | v21.15,6.35 21.15,10.48 20.51,11.11 18.61,11.11 15.75,13.97 v15.75,15.08 | 15.71,17.12 15.71,16.71 v15.75,16.67
  Bottom 0.203: v28.83,41.25 v28.83,43.25 | v22.33,35.5 v24.08,35.5 | v26.7,35.38 29.2,35.38 v29.58,35 | v23.53,6.35 v21.15,6.35 | v15.75,16.67 v15.75,15.08 | v34.48,2.86 v34.48,4.45
RETRIGGER_ENVELOPE  (via drill 0.3)
  Top 0.203: Q2.C 38.19,91.47 R42.1 35.95,91.5 35.45,91.5 35.33,91.62 35.33,91.88 34.58,92.62 29.83,92.62 v29.45,92.25 | IC5.8 31.82,72.11 v30.83,71.12 | v30.58,91.12 30.33,91.12 29.95,90.75 29.95,83.75 27.7,81.5 27.7,77.25 28.33,76.62 28.58,76.62 28.7,76.5 v28.7,76.38 | v28.7,74 28.45,73.75 28.45,72.12 v28.2,71.88
  Bottom 0.203: v30.83,71.12 30.08,71.88 v28.2,71.88 | v30.58,91.12 v29.45,92.25 | v28.7,74 v28.7,76.38
SCL  (via drill 0.3)
  Top 0.203: R50.2 34.01,84.62 34.95,84.62 35.56,84.02 IC6.1 35.56,77.73 v35.33,77.5 | v36.7,76 36.57,76.14 IC5.17
  Bottom 0.203: v35.33,77.5 35.33,77.38 v36.7,76
SDA
  Top 0.203: R51.2 38.76,84.62 37.95,84.62 37.45,84.11 IC6.3 37.45,82.74 36.33,81.62 36.33,77 35.95,76.62 IC5.18
SHIFTER1TO2  (via drill 0.3)
  Top 0.203: IC8.14 37.12,56.25 36.83,56.25 36.7,56.12 36.7,55 36.83,54.88 v36.95,54.88 | IC7.9 51.08,80.99 v50.32,80.23 | v48.83,77.62 46.45,75.25 46.45,70.62 45.7,69.88 42.33,69.88 41.7,69.25 41.7,65.12 39.58,63 39.58,60.5 38.95,59.88 37.45,59.88 v37.08,59.5
  Bottom 0.203: v48.83,77.62 48.83,78.74 v50.32,80.23 | v36.95,54.88 37.83,55.75 37.83,57.88 37.08,58.62 v37.08,59.5
SHIFTER2TO3  (via drill 0.3)
  Top 0.203: IC9.14 32.29,57.75 33.95,57.75 v35.58,59.38 | IC8.9 38.25,58.7 v37.95,59
  Bottom 0.203: v37.95,59 37.95,59.75 37.33,60.38 36.58,60.38 v35.58,59.38
SHIFTERS  (via drill 0.3)
  Top 0.203: IC7.14 52.83,85.14 v53.08,84.88 | v30.7,78.5 29.45,77.25 29.45,76.38 29.7,76.12 30.33,76.12 IC5.2 | v34.95,81.12 34.58,80.75 v32.95,80.75 | v36.95,81.12 36.95,81.25 v39.83,84.12 | v49.58,86.38 v46.2,86.38
  Bottom 0.203: v32.95,80.75 v30.7,78.5 | v36.95,81.12 v34.95,81.12 | v39.83,84.12 41.83,86.12 45.95,86.12 v46.2,86.38 | v53.08,84.88 50.08,84.88 49.58,85.38 v49.58,86.38
SWD_CLK  (via drill 0.3)
  Top 0.203: v33.83,83.25 33.83,83 32.33,81.5 IC5.22
  Bottom 0.203: SWD1.4 34.64,86.31 34.83,86.12 34.83,84.25 v33.83,83.25
SWD_DIO  (via drill 0.3)
  Top 0.203: v30.45,83.38 30.45,83 31.33,82.12 IC5.24
  Bottom 0.203: SWD1.2 31.87,84.79 v30.45,83.38
TRIGGER_ENVELOPE  (via drill 0.3)
  Top 0.203: Q1.C 26.62,91.95 R20.1 | IC5.13 34.78,73.8 36.45,72.12 38.08,72.12 38.33,72.38 38.33,73.75 37.83,74.25 v37.83,74.38 | R20.1 | v38.83,77.38 38.83,82.25 40.45,83.88 40.45,87.88 v40.2,88.12 | R20.1 27.94,93.25 34.95,93.25 35.65,92.56 36.75,92.56 37.13,92.18 39.07,92.18 39.47,91.78 39.47,91.36 v40.2,90.62
  Bottom 0.203: v38.83,77.38 38.45,77 38.45,75 v37.83,74.38 | v40.2,88.12 v40.2,90.62
TRIGGER_LED  (via drill 0.3)
  Top 0.203: v12.46,74.12 15.08,74.12 19.2,70 19.2,69.12 v22.45,65.88 | IC9.15 32.33,58.3 32.33,63.25 30.58,65 25.7,65 v25.08,65.62 | v10.08,74.12 9.21,75 9.21,88.86 12.73,92.39 12.73,92.46 12.32,92.87 12.32,93.86 15.62,97.16 21.07,97.16 21.33,96.89 36.68,96.89 R78.1
  Bottom 0.203: v22.45,65.88 24.83,65.88 v25.08,65.62 | v10.08,74.12 v12.46,74.12